# EAGLE design MAGHUG (EAGLE 7.6.0)
CNAME: http://gekkio.fi; CREVISION: v1.0; DESIGNER: gekkio
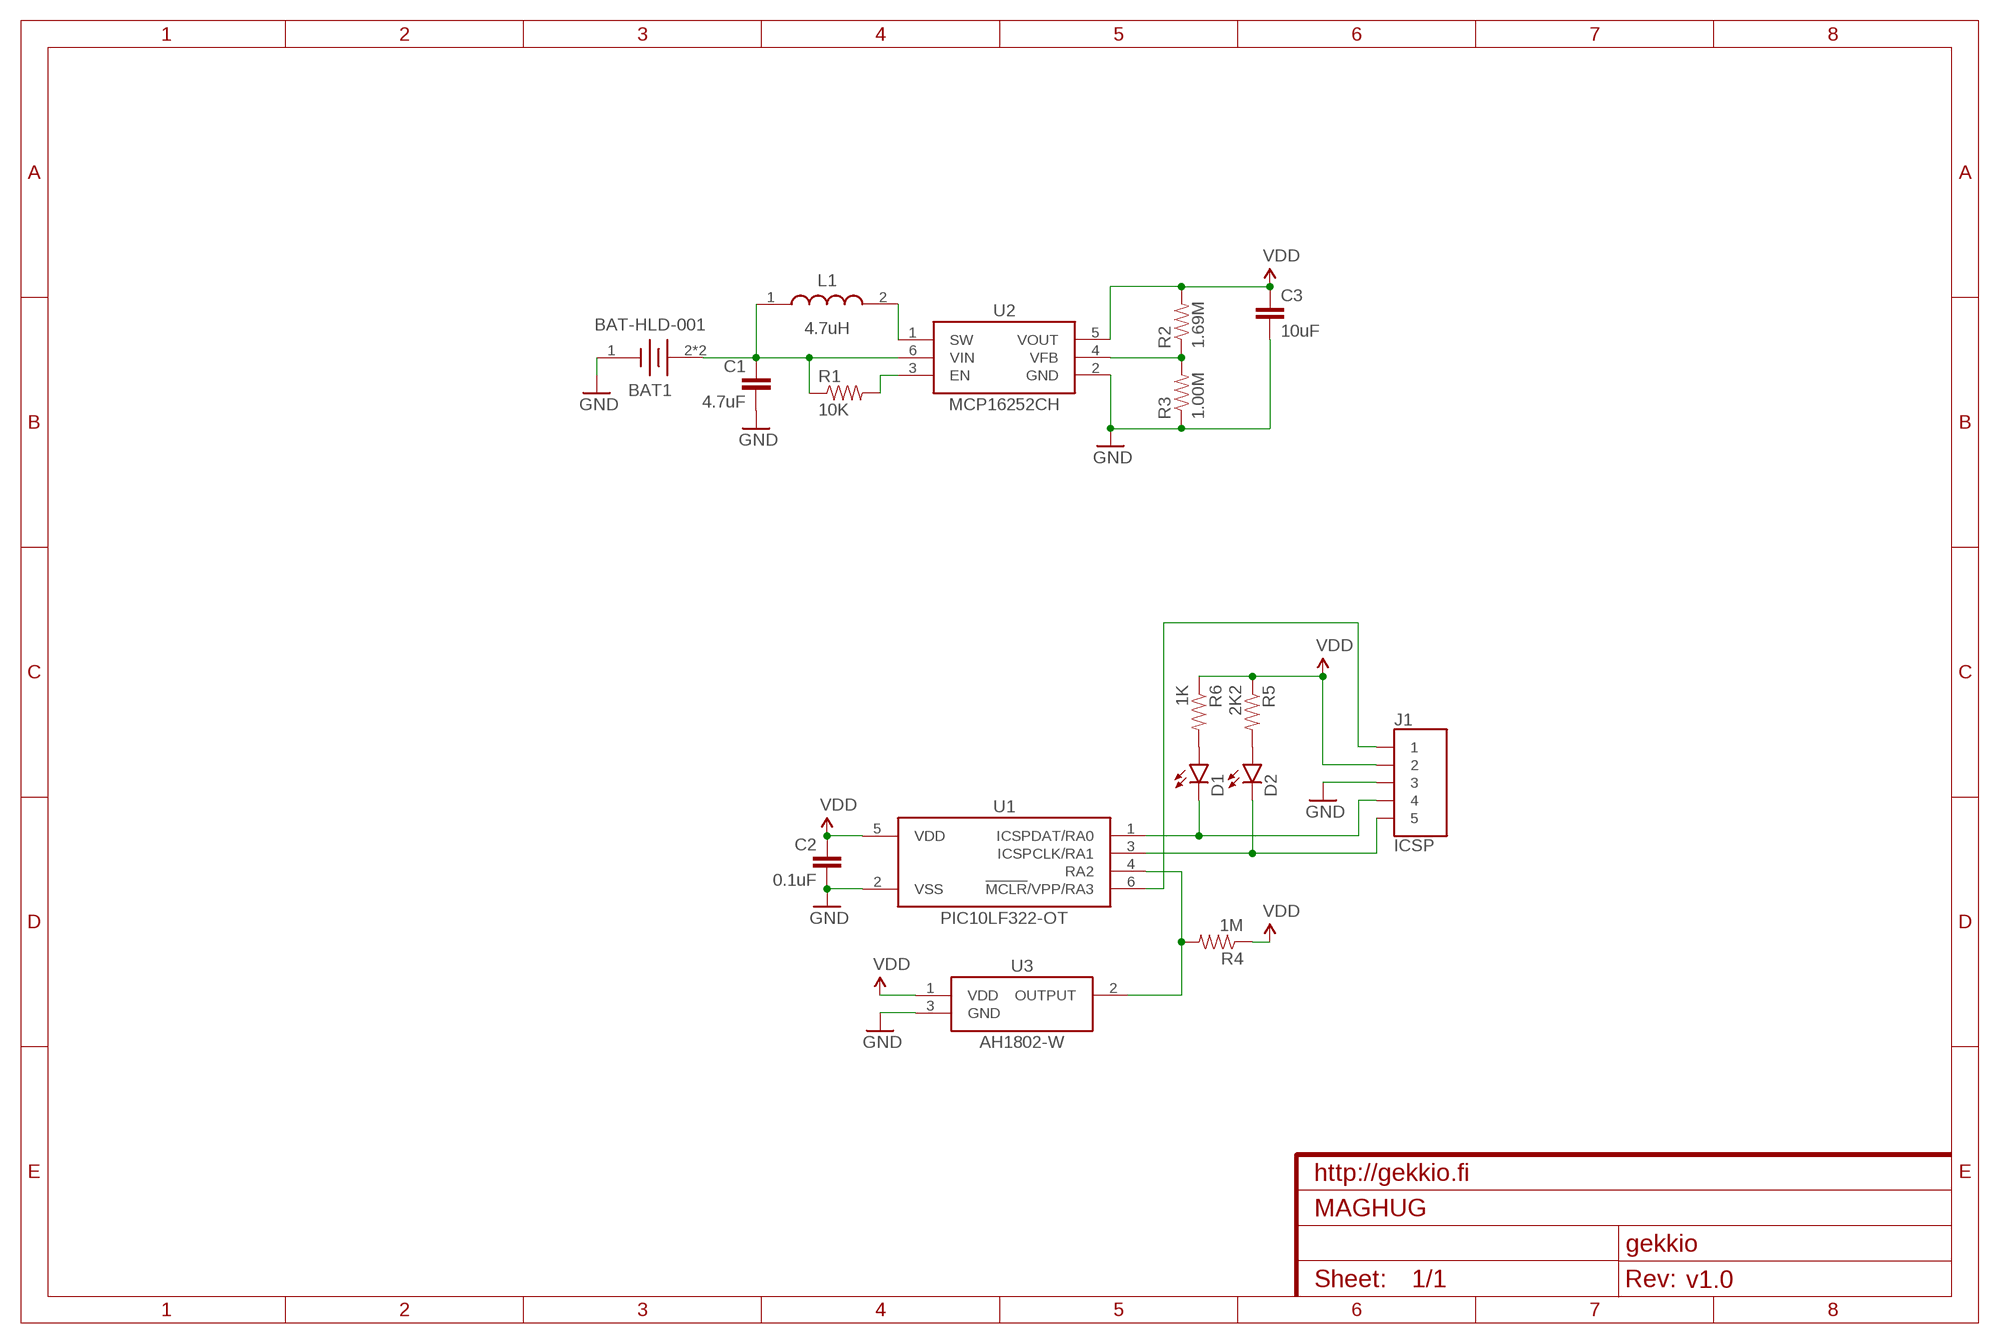
[diagram p0: schematic, sheet 1]

## Parts
BAT1  BAT-HLD-001  [BAT-HLD-001]
C1  4.7uF  CAP0805  [0805]
C2  0.1uF  CAP0603-CAP  [0603-CAP]
C3  10uF  CAP0805  [0805]
D1  LED-3MM-NO_SILK  [LED3MM-NS]
D2  LED-3MM-NO_SILK  [LED3MM-NS]
J1  ICSP  PINHD-1X5LONGPADS  [1X5-LONGPADS]
L1  4.7uH  VLS3015E  [VLS3015E]
R1  10K  RESISTOR0603-RES  [0603-RES]
R2  1.69M  RESISTOR0603-RES  [0603-RES]
R3  1.00M  RESISTOR0603-RES  [0603-RES]
R4  1M  RESISTOR0603-RES  [0603-RES]
R5  2K2  RESISTOR0603-RES  [0603-RES]
R6  1K  RESISTOR0603-RES  [0603-RES]
U1  PIC10LF322-OT  PIC10(L)F320/322-OT  [SOT-23(CH/CHY/OT)]
U2  MCP16252CH  MCP16251/2(6PIN)CH  [SOT-23(CH/CHY/OT)]
U3  AH1802-W  [SC59]

## Nets
!MCLR: J1.1 U1.6(!MCLR!/VPP/RA3)
EN: R1.2 U2.3(EN)
GND: BAT1.1(-) C1.2 C2.2 C3.2 J1.3 R3.1 U1.2(VSS) U2.2(GND) U3.3(GND)
N$2: R4.2 U1.4(RA2) U3.2(OUTPUT)
N$4: D1.A R6.2
N$5: D2.A R5.2
RA0: D1.K(C) J1.4 U1.1(ICSPDAT/RA0)
RA1: D2.K(C) J1.5 U1.3(ICSPCLK/RA1)
SW: L1.2 U2.1(SW)
VBAT: BAT1.2(+) BAT1.3(+) C1.1 L1.1 R1.1 U2.6(VIN)
VDD: C2.1 C3.1 J1.2 R2.2 R4.1 R5.1 R6.1 U1.5(VDD) U2.5(VOUT) U3.1(VDD)
VFB: R2.1 R3.2 U2.4(VFB)

## Library data of the parts
BAT1 = Gekkio-linx:BAT-HLD-001
C1-C3 = SparkFun-Passives:CAP: Capacitor Standard 0603 ceramic capacitor, and 0.1" leaded capacitor.
D1 D2 = SparkFun-LED:LED: LEDs Standard schematic elements and footprints for 5mm, 3mm, 1206, and 0603 sized LEDs. 5mm - Spark Fun Electronics SKU : COM-00529 (and others)
J1 = Gekkio-connector:PINHD-1X5
L1 = Gekkio-tdk:VLS3015E
R1-R6 = SparkFun-Passives:RESISTOR: Resistor Basic schematic elements and footprints for 0603, 1206, and PTH resistors.
U1 = Gekkio-microchip:PIC10(L)F320/322-?: 6/8-Pin Flash-Based, 8-Bit Microcontrollers
U2 = Gekkio-microchip:MCP16251/2(6PIN): Low Quiescent Current, PFM/PWM Synchronous Boost Regulator with True Output Disconnect or Input/Output Bypass Option
U3 = Gekkio-diodes-inc:AH1802-?: Micropower, Ultra-Sensitive Omnipolar Hall-Effect Sensor Switch

## Board
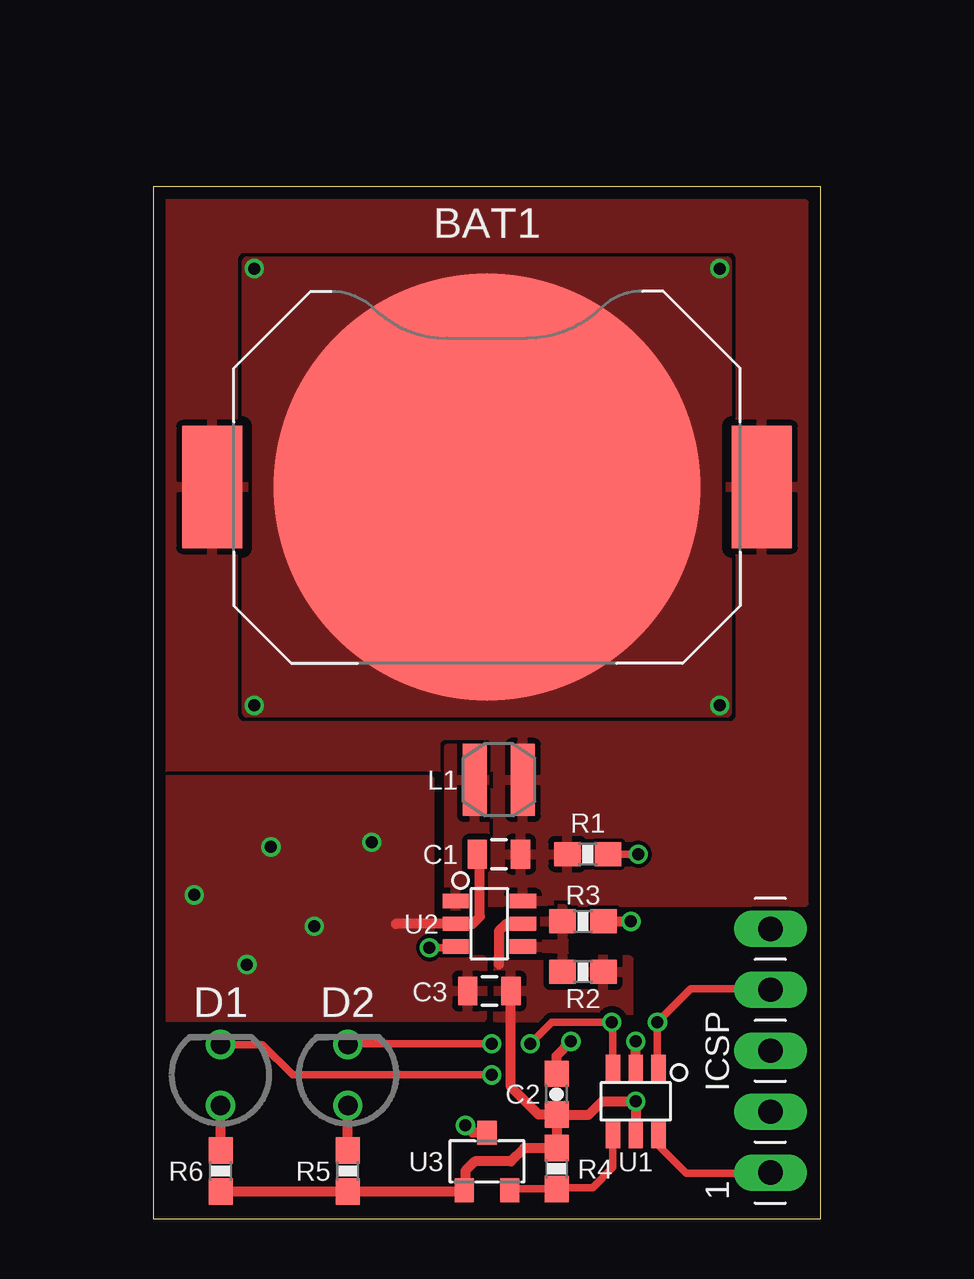
[diagram p1: board, top side]
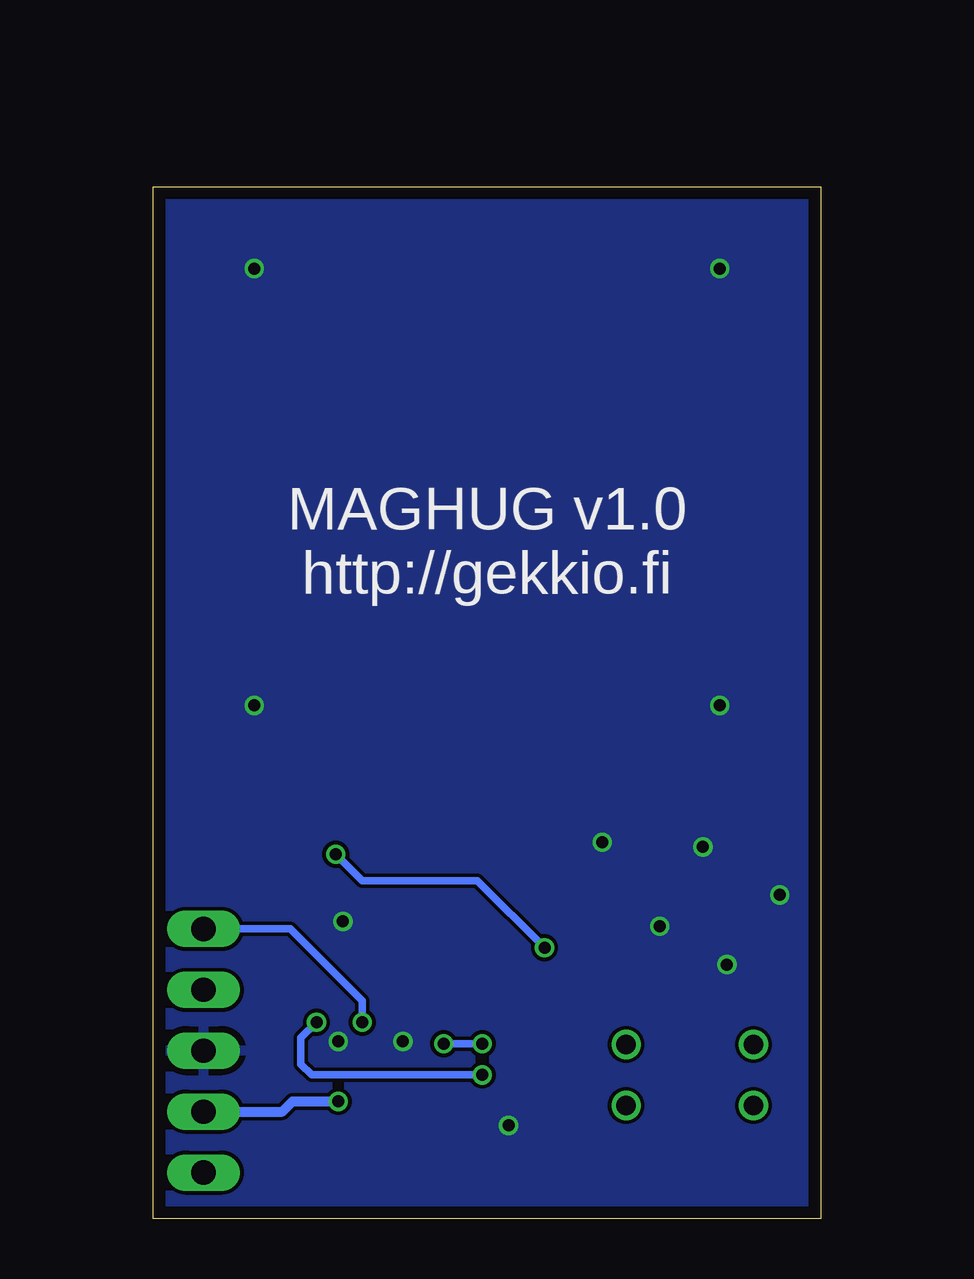
[diagram p2: board, bottom side, seen from below]

Size 27.8 x 43 mm. Coordinates in mm from the lower left corner, seen from the top.
Outline: 0,0 27.8,0 27.8,43 0,43 0,0
Copper layers (1*16): Top 0.035mm / dielectric 1.6mm / Bottom 0.035mm
Design rules "Elecrow_2-layer_PCB_eagle_rule *": minimum track width 6mil, minimum drill 12mil, track to track 6mil, track to pad 6mil, pad to pad 6mil, via to via 8mil, smd to smd 0mil, copper to edge 20mil, drill to drill 10mil, minimum pad ring 6mil, minimum via ring 6mil, stop-mask expansion 0mil, vias tented up to drill 100mil, thermal gap 10mil

### Footprints (pad centres in the part's own frame; a part is rotated, then mirrored left to right if it is on the bottom)
BAT-HLD-001 = smd 17.8 x 17.8: 1 0,0 | smd 2.5 x 5.1: 2 -11.45,0; 3 11.45,0
0805 = smd 0.8 x 1.2: 1 -0.9,0; 2 0.9,0
0603-CAP = smd 1.1 x 1: 1 -0.85,0; 2 0.85,0
LED3MM-NS = drill 0.813: A -1.27,0; K 1.27,0
1X5-LONGPADS = drill 1.016 long: 1 -5.08,0; 2 -2.54,0; 3 0,0; 4 2.54,0; 5 5.08,0
VLS3015E = smd 1 x 3: 1 -1,0; 2 1,0
0603-RES = smd 1.1 x 1: 1 -0.85,0; 2 0.85,0
SOT-23(CH/CHY/OT) = smd 1.1 x 0.6: 1 -1.4,0.95; 2 -1.4,0; 3 -1.4,-0.95; 4 1.4,-0.95; 5 1.4,0; 6 1.4,0.95
SC59 = smd 0.8 x 1: 1 -0.95,-1.2; 2 0.95,-1.2; 3 0,1.2

### Placement (x,y rotation side)
BAT1  13.9,30.5 180 top
C1  14.4,15.2 180 top
C2  16.8,5.2 90 top
C3  14,9.5 180 top
D1  2.8,6 90 top
D2  8.1,6 90 top
J1  25.71,7.01 90 top
L1  14.4,18.3 180 top
R1  18.1,15.2 0 top
R2  17.9,10.3 0 top
R3  17.9,12.4 180 top
R4  16.8,2.1 270 top
R5  8.1,2 90 top
R6  2.8,2 90 top
U1  20.1,4.9 270 top
U2  14,12.3 0 top
U3  13.9,2.4 0 top

### Tracks (layer width: path | path; a pad name or v marks a point on that pad's centre or on a via)
!MCLR
  Top 0.305: U1.6 21.05,3.05 22.2,1.9 25.68,1.9 J1.1
EN  (via drill 0.5)
  Top 0.305: v11.5,11.3 12.55,11.3 U2.3 | R1.2 v20.2,15.2
  Bottom 0.305: v11.5,11.3 14.3,14.1 19.1,14.1 v20.2,15.2
GND  (via drill 0.5)
  Top 0.406: R3.1 v19.9,12.4 | 10.1,12.3 U2.2 13.3,12.3 13.6,12.6 13.6,15.15 13.55,15.15 C1.2 | U3.3 13.3,3.6 v13,3.9 | U1.2 v20.1,7.4 | C2.2 16.8,6.8 v17.4,7.4
  other vias: 4.2,39.6 23.6,39.6 23.6,21.4 4.2,21.4 1.7,13.5 4.9,15.5 3.9,10.6 6.7,12.2 9.1,15.7
  pour Bottom: 0,43 0,0 27.8,0 27.8,43
  pour Top (isolate 0.406): 3.9,21.1 3.9,39.9 23.9,39.9 23.9,21.1
  pour Top: 0,18.3 11.5,18.3 11.5,10.8 13.7,10.8 13.7,8.4 0,8.4
N$2
  Top 0.305: U1.4 19.15,2.15 18.3,1.3 16.85,1.3 R4.2 14.9,1.25 U3.2
N$4
  Top 0.406: R6.2 D1.A
N$5
  Top 0.406: R5.2 D2.A
RA0  (via drill 0.5)
  Top 0.305: J1.4 25.66,9.6 22.4,9.6 v21,8.2 21,6.35 U1.1 | D1.K 4.53,7.27 5.8,6 v14.1,6
  Bottom 0.305: v14.1,6 21.2,6 21.65,6.45 21.65,7.55 v21,8.2
RA1  (via drill 0.5)
  Top 0.305: U1.3 19.15,8.15 v19.1,8.2 16.6,8.2 v15.7,7.3 | D2.K 8.13,7.3 v14.1,7.3
  Bottom 0.305: J1.5 22.09,12.09 19.1,9.1 v19.1,8.2 | v14.1,7.3 v15.7,7.3
SW
  pour Top (isolate 0.254): 12.3,13 13.8,13 13.8,19.6 12.3,19.6
VBAT
  pour Top (rank 2): 0,42.3 27.1,42.3 27.1,13.2 0,13.2
VDD  (via drill 0.5)
  Top 0.406: U2.5 14.7,12.3 14.4,12 14.4,10.6 | C2.1 R4.1 15.45,2.95 14.9,2.4 13.4,2.4 13,2 13,1.25 U3.1 12.9,1.15 R5.1 R6.1 | C2.1 16.05,4.35 14.9,5.5 C3.1 | C2.1 18.15,4.35 18.7,4.9 v20.1,4.9 U1.5
  Bottom 0.406: J1.2 22.43,4.47 22,4.9 v20.1,4.9
  pour Top (isolate 0.254, rank 2): 14.3,10.8 14.3,8.4 19.8,8.4 19.8,10.8
VFB
  pour Top: 17.1,12.9 15.8,12.9 15.8,11.3 16.8,11.3 16.8,10.8 17.1,10.8

### Text on the board
tPlace: 1
bPlace: MAGHUG v1.0 / http://gekkio.fi